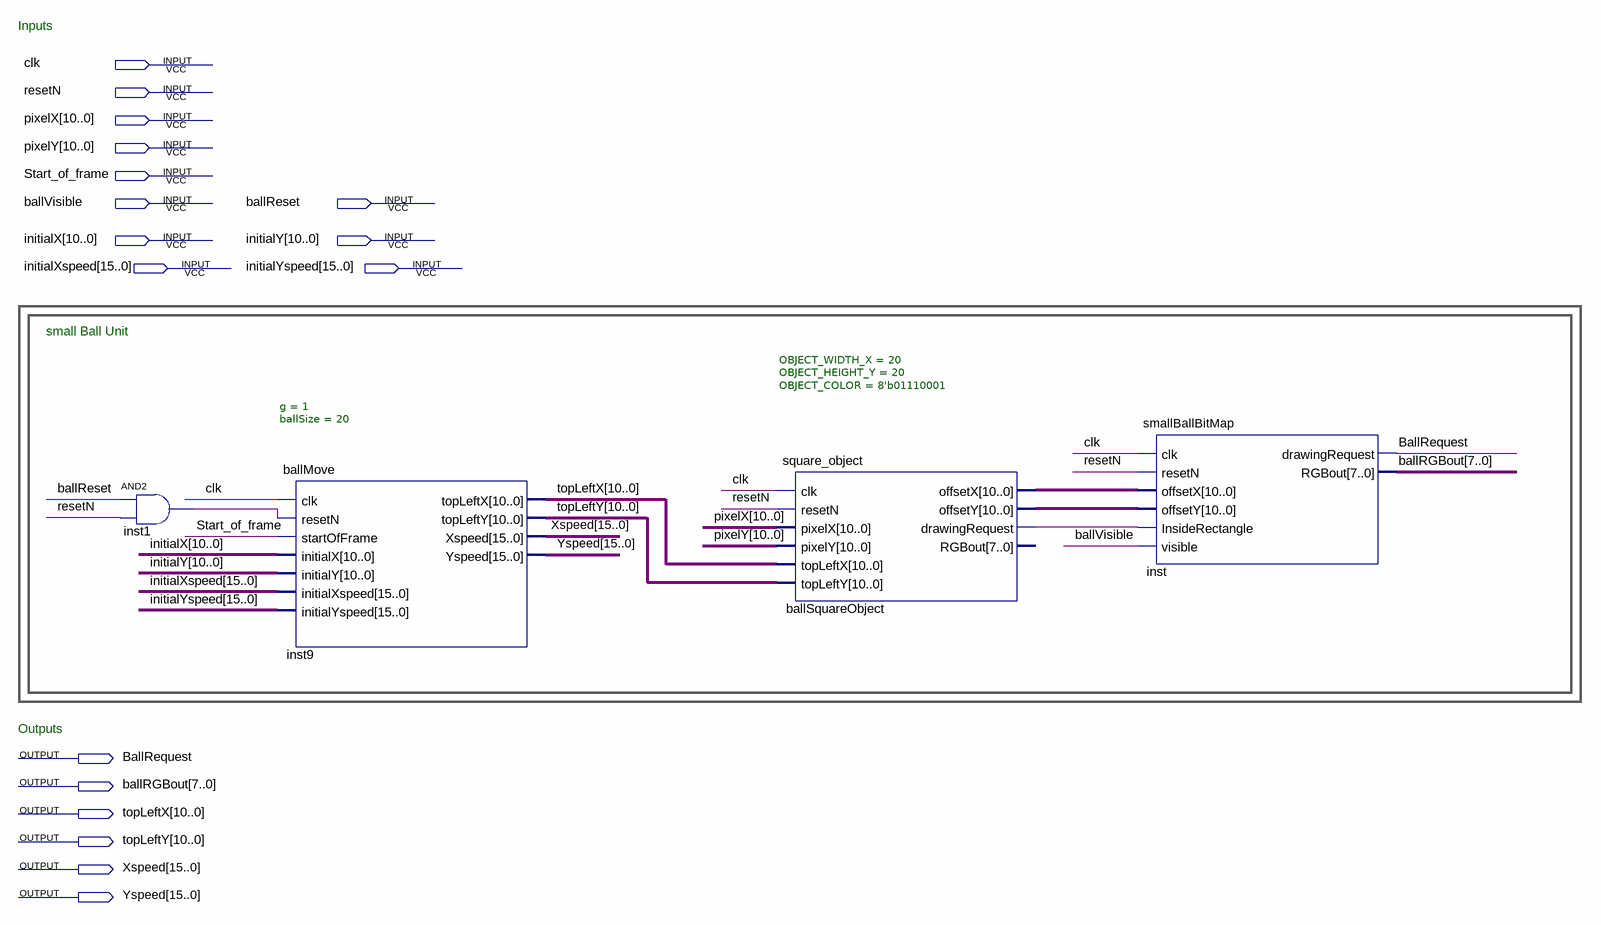
[diagram p0: schematic sheet]
// Quartus schematic Small_Ball_TOP.bdf as structural Verilog: 4 symbols, 17 pins
module Small_Ball_TOP (
  input  clk,
  input  resetN,
  input  [10:0] pixelX,
  input  [10:0] pixelY,
  input  Start_of_frame,
  input  ballVisible,
  input  ballReset,
  input  [10:0] initialX,
  input  [10:0] initialY,
  input  [15:0] initialXspeed,
  input  [15:0] initialYspeed,
  output BallRequest,
  output [7:0] ballRGBout,
  output [10:0] topLeftX,
  output [10:0] topLeftY,
  output [15:0] Xspeed,
  output [15:0] Yspeed
);

  wire ballSquareObject_drawingrequest, inst1_out;
  wire [10:0] ballSquareObject_offsetx, ballSquareObject_offsety;

  and inst1 (inst1_out, ballReset, resetN);
  ballMove #(.g(1), .ballSize(20)) inst9 (
    .clk(clk), .resetN(inst1_out), .startOfFrame(Start_of_frame), .initialX(initialX), .initialY(initialY),
    .initialXspeed(initialXspeed), .initialYspeed(initialYspeed), .topLeftX(topLeftX), .topLeftY(topLeftY),
    .Xspeed(Xspeed), .Yspeed(Yspeed));
  square_object #(.OBJECT_WIDTH_X(20), .OBJECT_HEIGHT_Y(20), .OBJECT_COLOR(8'b01110001)) ballSquareObject (
    .clk(clk), .resetN(resetN), .pixelX(pixelX), .pixelY(pixelY), .topLeftX(topLeftX), .topLeftY(topLeftY),
    .offsetX(ballSquareObject_offsetx), .offsetY(ballSquareObject_offsety),
    .drawingRequest(ballSquareObject_drawingrequest));  // open: RGBout
  smallBallBitMap inst (
    .clk(clk), .resetN(resetN), .offsetX(ballSquareObject_offsetx), .offsetY(ballSquareObject_offsety),
    .InsideRectangle(ballSquareObject_drawingrequest), .visible(ballVisible), .drawingRequest(BallRequest),
    .RGBout(ballRGBout));

  // Notes on the sheet:
  //   Inputs
  //   small Ball Unit
  //   Outputs
endmodule
